# Altium schematic sheet Digital.SchDoc
size A4; SheetNumber: 3; SheetTotal: 3
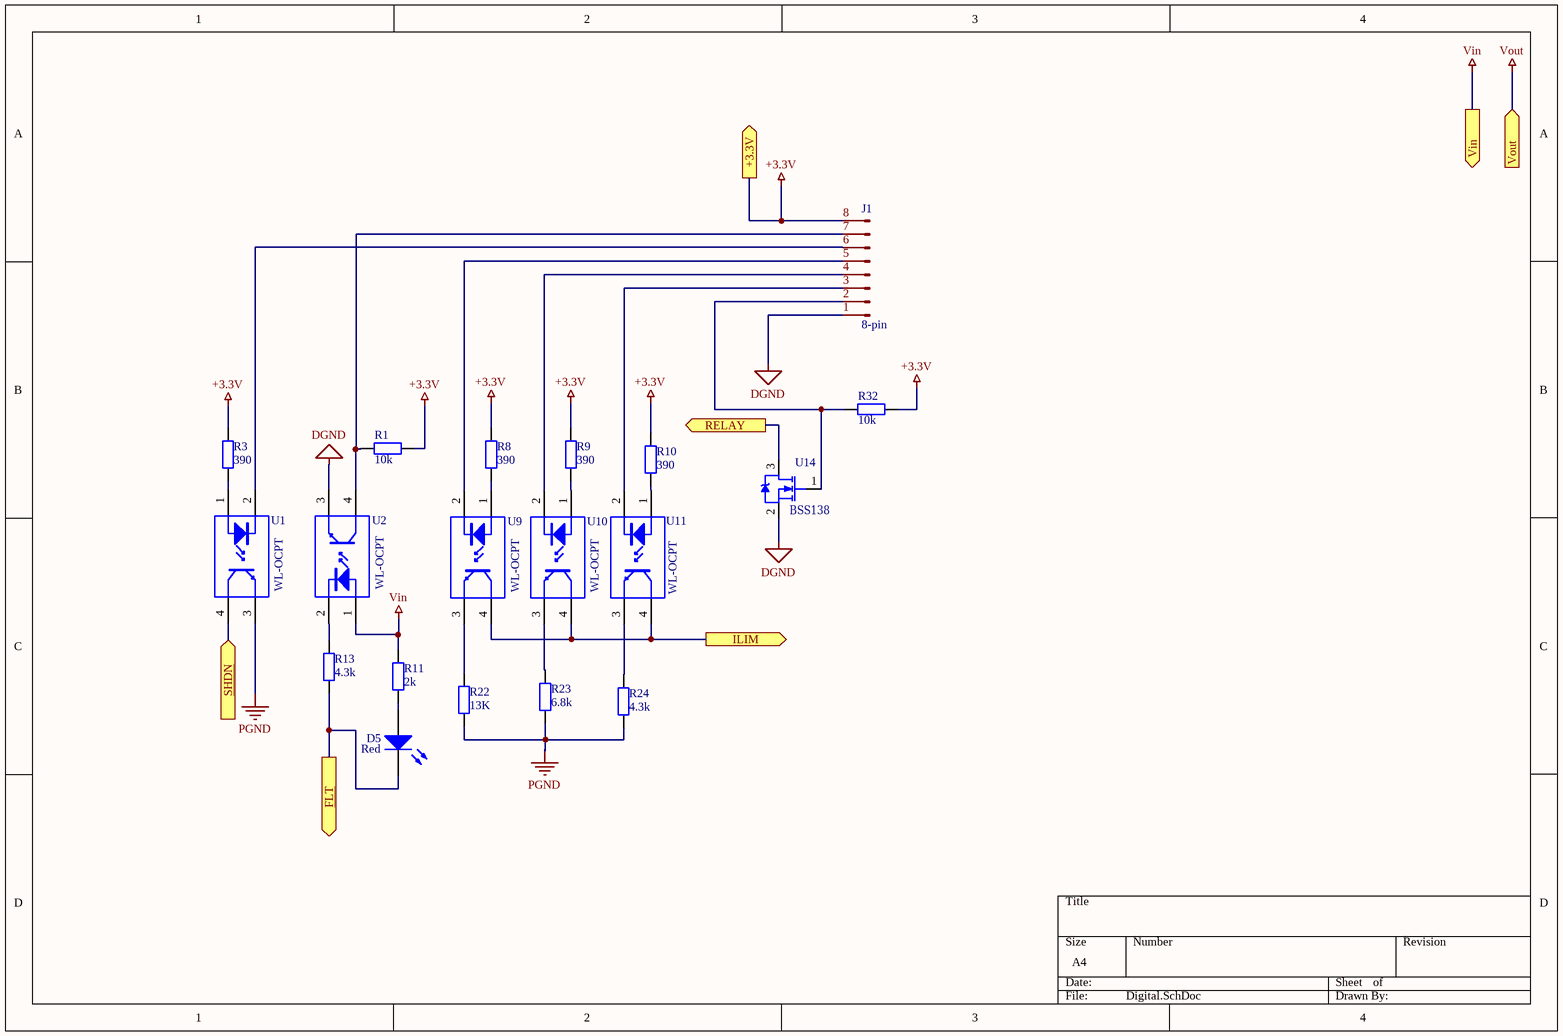
[diagram p0: Digital.SchDoc]

## Parts
D5  Red  [0805 LED]
J1  8-pin  [JST_XH_B8B-XH-A_1x08_P2.50mm_Vertical]
R1  10k  [0805]
R3  390  [0805]
R8  390  [0805]
R9  390  [0805]
R10  390  [0805]
R11  2k  [0805]
R13  4.3k  [0805]
R22  13K  [0805]
R23  6.8k  [0805]
R24  4.3k  [0805]
R32  10k  [0805]
U1  WL-OCPT  [4-SOP_WE_opto-isolator]
U2  WL-OCPT  [4-SOP_WE_opto-isolator]
U9  WL-OCPT  [4-SOP_WE_opto-isolator]
U10  WL-OCPT  [4-SOP_WE_opto-isolator]
U11  WL-OCPT  [4-SOP_WE_opto-isolator]
U14  BSS138‎  [SOT-23-3]

## Ports
+3.3V (out), FLT (out), ILIM (out), RELAY (out), SHDN (in), Vin (out), Vout (in)

## Nets
+3.3V: J1.8(Pin_8) R1.1 R3.2 R8.2 R9.2 R10.2 R32.2 ; port +3.3V
DGND: J1.1(Pin_1) U2.3(E) U14.2(D)
PGND: R22.1 R23.1 R24.1 U1.3(E)
Vin: R11.2 U2.1(A) ; port Vin
Vout: port Vout
FLT: D5.1(K) R13.1 ; port FLT
ILIM: U9.4(C) U10.4(C) U11.4(C) ; port ILIM
RELAY: U14.3(S) ; port RELAY
SHDN: U1.4(C) ; port SHDN
NetD5_2: D5.2(A) R11.1
NetJ1_2: J1.2(Pin_2) R32.1 U14.1(G)
NetJ1_3: J1.3(Pin_3) U11.2(C)
NetJ1_4: J1.4(Pin_4) U10.2(C)
NetJ1_5: J1.5(Pin_5) U9.2(C)
NetJ1_6: J1.6(Pin_6) U1.2(C)
NetJ1_7: J1.7(Pin_7) R1.2 U2.4(C)
NetR3_1: R3.1 U1.1(A)
NetR8_1: R8.1 U9.1(A)
NetR9_1: R9.1 U10.1(A)
NetR10_1: R10.1 U11.1(A)
NetR13_2: R13.2 U2.2(C)
NetR22_2: R22.2 U9.3(E)
NetR23_2: R23.2 U10.3(E)
NetR24_2: R24.2 U11.3(E)

## Library data of the parts
D5 = LED
R1 R3 R8-R11 R13 R22-R24 R32 = res0805
U1 U2 U9-U11 = optoc WE
U14 = N-mosfet en